# Altium schematic sheet 2418driver.SchDoc
size A4
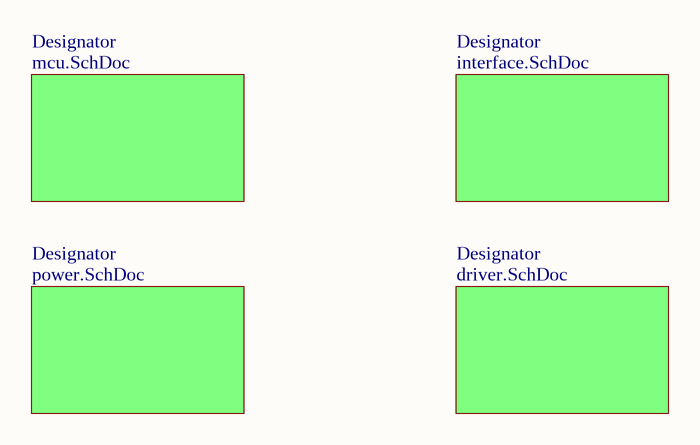
[diagram p0: 2418driver.SchDoc]

## Sub-sheets
Designator = mcu.SchDoc: no entries
Designator = interface.SchDoc: no entries
Designator = power.SchDoc: no entries
Designator = driver.SchDoc: no entries